# EAGLE design adaptador_vga_scart_activo (EAGLE 7.3.0)
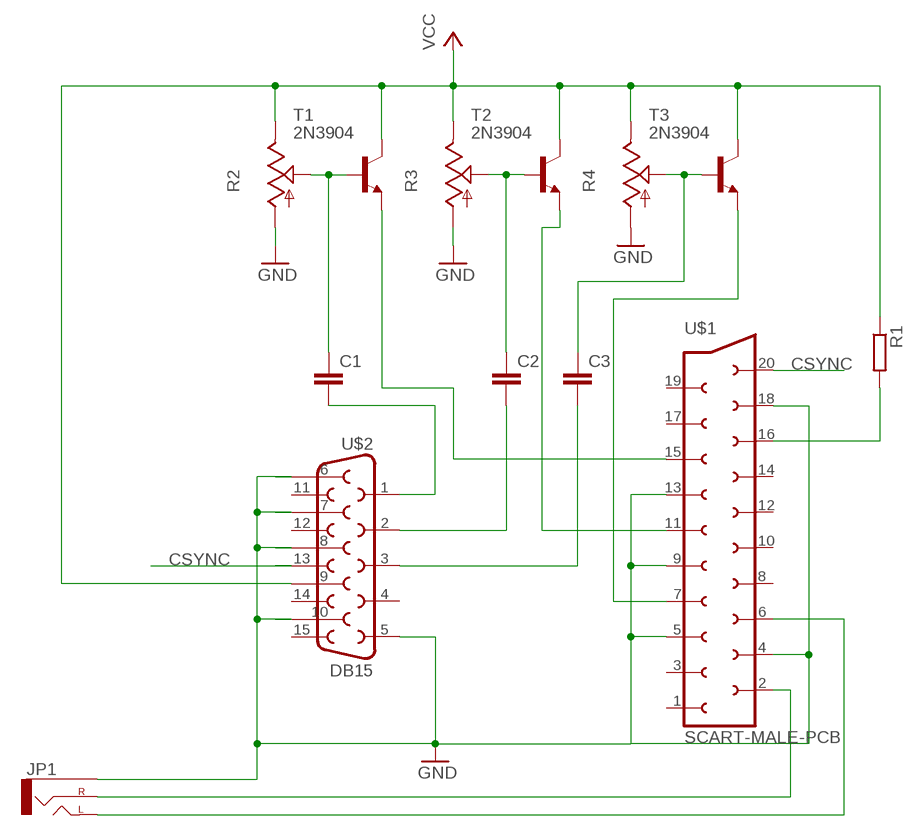
[diagram p0: schematic, sheet 1]

## Parts
C1  C2,5-3  [C2.5-3]
C2  C2,5-3  [C2.5-3]
C3  C2,5-3  [C2.5-3]
JP1  AUDIO-JACKPTH  [AUDIO-JACK]
R1  R-EU_0204/5  [0204/5]
R2  TRIM_US-CA6V  [CA6V]
R3  TRIM_US-CA6V  [CA6V]
R4  TRIM_US-CA6V  [CA6V]
T1  2N3904  [TO92]
T2  2N3904  [TO92]
T3  2N3904  [TO92]
U$1  SCART-MALE-PCB  [SCART-PCB]
U$2  DB15  [DB15]

## Nets
BIN: C3.1 R4.S T3.2(B)
BOUT: T3.3(E) U$1.7
CSYNC: U$1.20 U$2.13
GIN: C2.2 U$2.2
GND: JP1.SLEEVE R2.A R3.A R4.A U$1.4 U$1.5 U$1.9 U$1.13 U$1.18 U$2.5 U$2.6 U$2.7 U$2.8 U$2.10
GOUT: T2.3(E) U$1.11
LEFT: JP1.TIP(LEFT) U$1.6
N$1: C1.1 R2.S T1.2(B)
N$3: C2.1 R3.S T2.2(B)
N$4: C3.2 U$2.3
N$7: R1.2 U$1.16
RIGHT: JP1.RING(RIGHT) U$1.2
RIN: C1.2 U$2.1
ROUT: T1.3(E) U$1.15
VCC: R1.1 R2.E R3.E R4.E T1.1(C) T2.1(C) T3.1(C) U$2.9
Unconnected: U$1.1 U$1.3 U$1.8 U$1.10 U$1.12 U$1.14 U$1.17 U$1.19 U$2.4 U$2.11 U$2.12 U$2.14 U$2.15

## Library data of the parts
C1-C3 = capacitor-wima:C: CAPACITOR naming: grid - package width
JP1 = SparkFun-Connectors:AUDIO-JACK: 3.5mm Audio Jack Simple 3.5mm common PCB mount audio jack. SKU: PRT-08032
R1 = rcl:R-EU_: RESISTOR, European symbol
R2-R4 = pot:TRIM_US-: POTENTIOMETER
T1-T3 = transistor:2N3904: NPN TRANSISTOR
U$1 = con-hirschmann:SCART-MALE-PCB
U$2 = SparkFun-Connectors:DB15: DB15 / VGA right angle through-hole female connector.

## Board
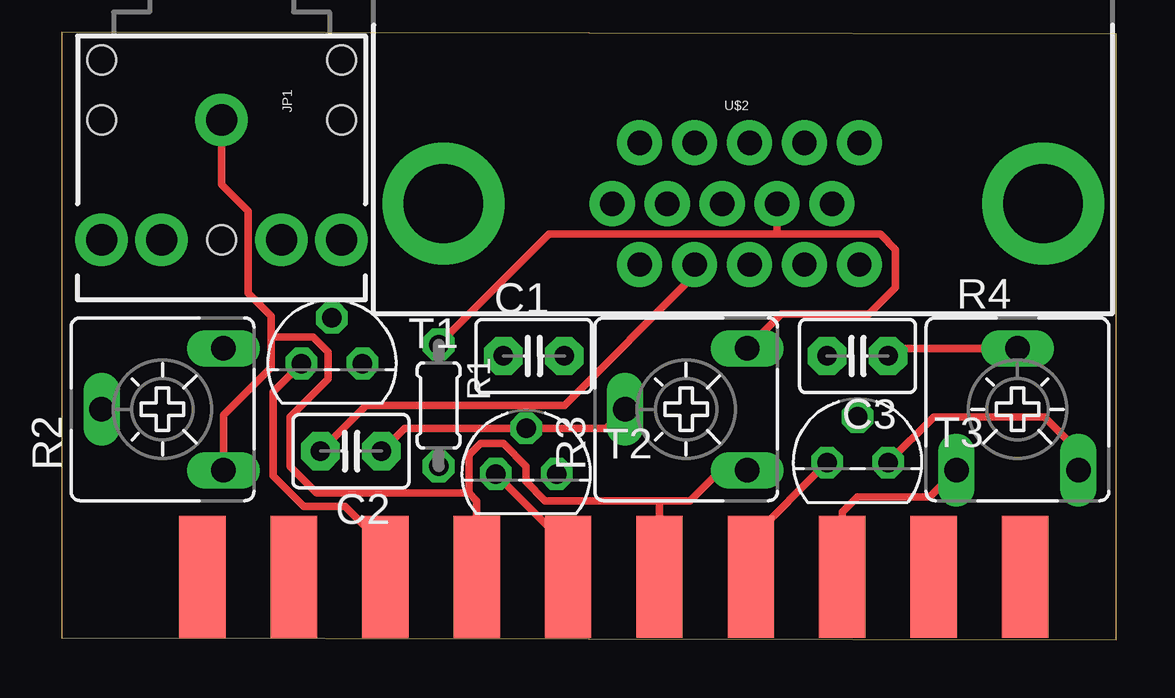
[diagram p1: board, top side]
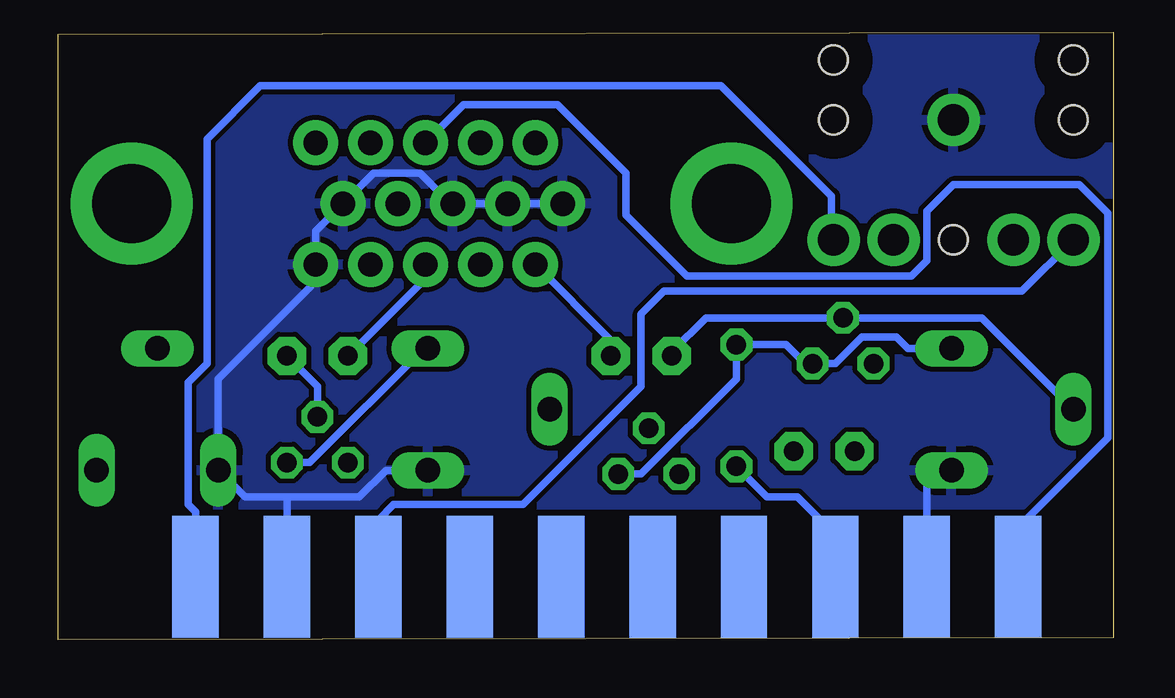
[diagram p2: board, bottom side, seen from below]

No outline drawn. Coordinates in mm, seen from the top.
Copper layers (1*16): Top 0.035mm / dielectric 1.5mm / Bottom 0.035mm
Design rules "default": minimum track width 10mil, minimum drill 24mil, track to track 8mil, track to pad 8mil, pad to pad 8mil, via to via 8mil, smd to smd 8mil, copper to edge 40mil, drill to drill 8mil, minimum pad ring 10mil, minimum via ring 8mil, stop-mask expansion 4mil, vias tented up to drill 0mil, thermal gap 10mil
Milling: 4 lines

### Footprints (pad centres in the part's own frame; a part is rotated, then mirrored left to right if it is on the bottom)
C2.5-3 = drill 0.813 pad 1.6 octagon: 1 -1.27,0; 2 1.27,0
AUDIO-JACK = drill 1.3 pad 2.184: RING 5,5; RSH 5,2.5; SLEEVE 0,0; TIP 5,-5; TSH 5,-2.5 | hole 1.2: 0,5; -2.5,5; -2.5,-5; 0,-5; 5,0
0204/5 = drill 0.813 octagon: 1 -2.54,0; 2 2.54,0
CA6V = drill 1.016 long: A -2.54,-2.54; E 2.54,-2.54; S 0,2.54
TO92 = drill 0.813 octagon: 1 1.27,0; 2 0,1.905; 3 -1.27,0
SCART-PCB = smd 1.93 x 5.08: 1 17.145,0; 3 13.335,0; 5 9.525,0; 7 5.715,0; 9 1.905,0; 11 -1.905,0; 13 -5.715,0; 15 -9.525,0; 17 -13.335,0; 19 -17.145,0 | smd 1.93 x 5.08 bottom: 2 15.24,0; 4 11.43,0; 6 7.62,0; 8 3.81,0; 10 0,0; 12 -3.81,0; 14 -7.62,0; 16 -11.43,0; 18 -15.24,0; 20 -19.05,0
DB15 = drill 1.016 pad 1.88: 1 -4.32,-7.62; 2 -2.03,-7.62; 3 0.26,-7.62; 4 2.55,-7.62; 5 4.84,-7.62; 6 -5.46,-5.08; 7 -3.17,-5.08; 8 -0.88,-5.08; 9 1.41,-5.08; 10 3.7,-5.08; 11 -4.32,-2.54; 12 -2.03,-2.54; 13 0.26,-2.54; 14 2.55,-2.54; 15 4.84,-2.54 | drill 3.302 pad 5.08: G1 -12.5,-5.08; G2 12.5,-5.08

### Placement (x,y rotation side)
C1  19.68,11.75 0 top
C2  12.06,7.78 180 top
C3  33.18,11.75 180 top
JP1  6.67,21.59 270 top
R1  15.72,9.68 270 top
R2  4.21,9.53 90 top
R3  26.04,9.53 90 top
R4  39.85,9.53 0 top
T1  11.27,11.43 0 top
T2  19.37,6.83 0 top
T3  33.18,7.3 0 top
U$1  23.02,2.54 0 top
U$2  28.42,23.18 0 top

### Tracks (layer width: path | path; a pad name or v marks a point on that pad's centre or on a via)
BIN
  Top 0.305: R4.S 34.77,12.06 C3.1
  Bottom 0.305: T3.2 33.18,10.48 C3.1
BOUT
  Top 0.305: U$1.7 28.73,4.13 T3.3
CSYNC
  Bottom 0.305: U$1.20 3.97,4.6 0.24,8.33 0.24,17.7 1.43,18.89 6.67,18.89 7.78,17.78 7.78,15.72 8.41,15.08 17.78,15.08 20.32,17.62 20.32,19.37 23.18,22.23 27.09,22.23 U$2.13
GIN
  Top 0.305: C2.2 12.7,9.68 20.95,9.68 26.39,15.12 U$2.2
GND
  Top 0.305: U$1.5 32.54,5.24 33.18,5.87 36.2,5.87 R4.A | U$1.9 24.92,5.71 | R3.A 27.46,6.99 26.19,5.71 24.92,5.71 | U$1.13 17.3,5.71 16.99,6.03 | 16.99,6.03 16.99,7.62 17.46,8.1 18.41,8.1 19.37,7.14 19.37,6.51 20.16,5.71 24.92,5.71 | 16.99,6.03 10.64,6.03 9.53,7.14 9.53,9.21 11.11,10.79 11.11,11.91 10.48,12.54 8.81,12.54 8.73,12.46 | JP1.SLEEVE 6.67,18.89 7.78,17.78 7.78,14.37 8.73,13.41 8.73,12.46 | R2.A 6.75,9.29 8.73,11.27 8.73,12.46
  Bottom 0.305: 34.45,5.87 U$1.4 | R3.A 30.32,6.99 31.43,5.87 34.45,5.87 | 34.45,5.87 36.2,5.87 R4.A 37.31,10.79 33.26,14.85 U$2.5 33.26,16.96 U$2.10 30.85,19.37 28.89,19.37 27.62,18.1 U$2.8 U$2.7 U$2.6 | U$1.18 7.78,6.35 R2.A
  pour Bottom: 0.24,24.92 43.66,24.92 43.66,5.56 0.24,5.56
GOUT
  Top 0.305: U$1.11 21.11,3.81 T2.3
LEFT
  Bottom 0.305: U$1.6 30.64,4.92 30,5.56 24.61,5.56 19.68,10.48 19.68,13.49 18.73,14.45 3.81,14.45 JP1.TIP
N$1
  Bottom 0.305: C1.1 18.41,11.91 16.99,13.34 T1.2 5.48,13.34 R2.S
N$3
  Top 0.305: C2.1 14.29,8.73 T2.2 22.7,8.73 R3.S
N$4
  Bottom 0.305: U$2.3 28.68,14.98 C3.2
N$7
  Bottom 0.305: U$1.16 11.59,4.29 13.18,5.87 14.45,5.87 R1.2
RIGHT
  Bottom 0.305: U$1.2 38.26,5.24 38.58,5.56 38.58,10.64 37.78,11.43 37.78,20.8 35.56,23.02 16.35,23.02 11.75,18.41 11.75,16.67 JP1.RING
RIN
  Bottom 0.305: C1.2 20.95,12.42 U$2.1
ROUT
  Top 0.305: U$1.15 13.49,3.81 11.83,5.48 10.08,5.48 8.81,6.75 8.81,10.24 T1.3
VCC
  Top 0.305: R4.E 42.39,7.78 40.96,9.21 36.35,9.21 T3.1 | R3.E 30,13.49 33.66,13.49 34.77,14.61 34.77,16.19 34.13,16.83 29.84,16.83 | 29.84,16.83 20.32,16.83 R1.1 | U$2.9 29.83,16.85 29.84,16.83
  Bottom 0.305: T3.1 33.5,7.3 28.73,12.06 R3.E | T2.1 19.68,6.83 15.72,10.79 R1.1 13.65,12.22 12.86,11.43 T1.1 11.59,11.43 10.48,12.54 9.05,12.54 8.57,12.06 R2.E